# EAGLE schematic Кроватная подсветка (EAGLE 6.1)
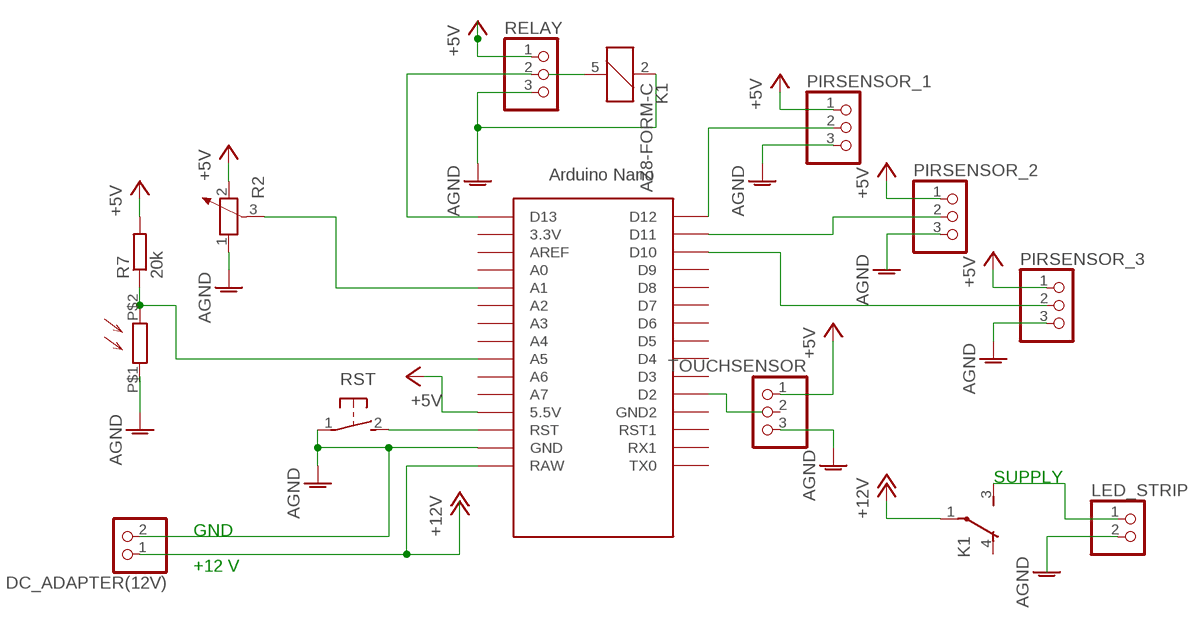
[diagram p0: schematic, sheet 1]

## Parts
DC_ADAPTER(12V)  PINHD-1X2  [1X02]
K1  AZ8-FORM-C  [AZ8]
LED_STRIP  PINHD-1X2  [1X02]
PIRSENSOR_1  PINHD-1X3  [1X03]
PIRSENSOR_2  PINHD-1X3  [1X03]
PIRSENSOR_3  PINHD-1X3  [1X03]
R2  POTENTIOMETER_PT-10S  [PT-10S]
R6  PHOTO-RESISTOR  [PHOTO-RESISTOR]
R7  20k  R-EU_0207/10  [0207/10]
RELAY  PINHD-1X3  [1X03]
RST  31-XX  [B3F-31XX]
TOUCHSENSOR  PINHD-1X3  [1X03]
U$1  NANO  [NANO]

## Nets
+5V: PIRSENSOR_1.1 PIRSENSOR_2.1 PIRSENSOR_3.1 R2.2 R7.2 RELAY.1 TOUCHSENSOR.1 U$1.5V(5.5V)
+12V: K1.1(-1:P)
AGND: DC_ADAPTER(12V).2 K1.2 PIRSENSOR_1.3 PIRSENSOR_3.3 R2.1 R6.P$1 RELAY.3 RST.1(P) TOUCHSENSOR.3 U$1.GND
N$1: R6.P$2 R7.1 U$1.A5
N$2: K1.5
N$3: RELAY.2 U$1.D13
N$4: U$1.D2
N$5: K1.3(-1:S) LED_STRIP.1
N$6: DC_ADAPTER(12V).1 U$1.RAW
N$7: PIRSENSOR_2.3
N$8: RST.2(S) U$1.RST
N$9: LED_STRIP.2
N$10: PIRSENSOR_3.2 U$1.D10
N$11: R2.3 U$1.A1
N$12: PIRSENSOR_1.2 U$1.D12
N$13: PIRSENSOR_2.2 U$1.D11
Unconnected: K1.4(-1:O) TOUCHSENSOR.2 U$1.3.3V U$1.A0 U$1.A2 U$1.A3 U$1.A4 U$1.A6 U$1.A7 U$1.AREF U$1.D3 U$1.D4 U$1.D5 U$1.D6 U$1.D7 U$1.D8 U$1.D9 U$1.GND1(GND2) U$1.ICSP1 U$1.ICSP2 U$1.ICSP3 U$1.ICSP4 U$1.ICSP5 U$1.ICSP6 U$1.RST1 U$1.RX1 U$1.TX0

## Notes on the sheet
- SUPPLY
- GND
- +12 V

## Library data of the parts
DC_ADAPTER(12V) LED_STRIP = pinhead:PINHD-1X2: PIN HEADER
K1 = relay:AZ8-FORM-C: MINIATURE PC BOARD RELAY Form C Source: www.azettler.com .. AZ8-1ch-12DSE.PDF; OC_FARNELL: unknown; OC_NEWARK: unknown
PIRSENSOR_1-PIRSENSOR_3 RELAY TOUCHSENSOR = pinhead:PINHD-1X3: PIN HEADER
R2 = rcl:POTENTIOMETER_: Potentiometer
R6 = photoresistor:PHOTO-RESISTOR
R7 = resistor:R-EU_: RESISTOR, European symbol
RST = switch-omron:31-XX: OMRON SWITCH; MPN: B3F-3100; OC_FARNELL: 959704; OC_NEWARK: 36M3582
U$1 = Arduino-clone:NANO: Arduino Nano